# Altium project 1240MHZ-Reciever.PrjPcb
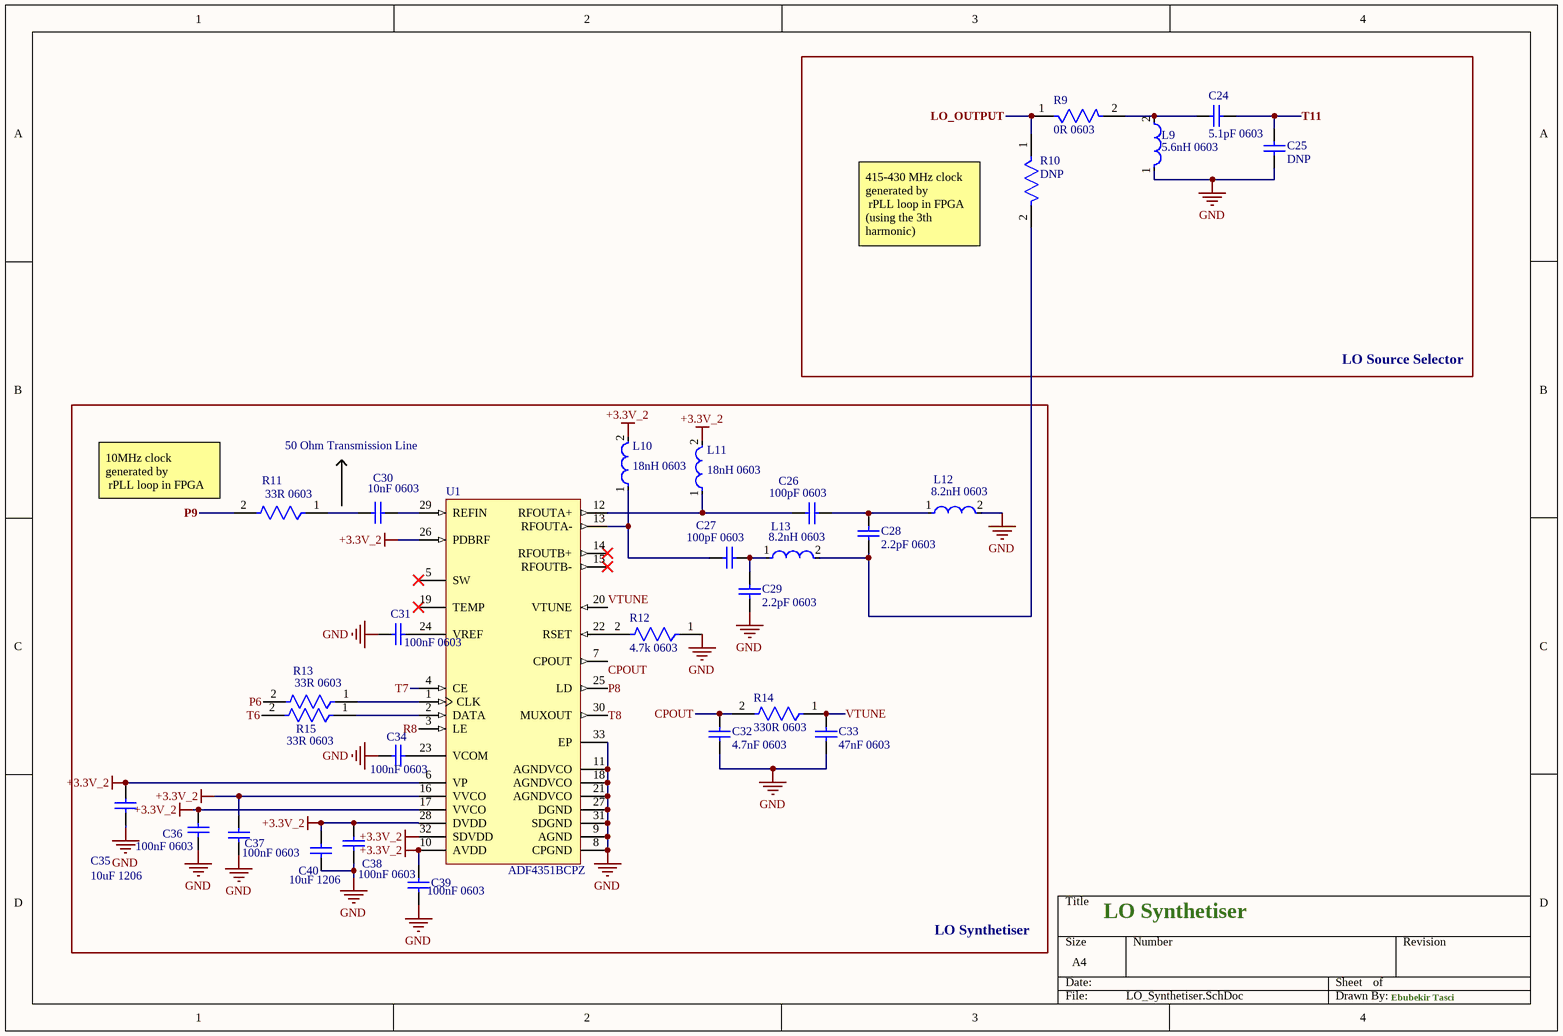
[diagram p0: LO_Synthetiser.SchDoc]
3 sheets, 113 parts. Net scope: global (net labels, ports and power ports of the same name join across sheets).
Board file: Main.PcbDoc
Sheets:
  LO_Synthetiser.SchDoc
  BaseBand.SchDoc
  Headers_Power.SchDoc

## Sheet LO_Synthetiser.SchDoc
size A4; SheetNumber: 1; SheetTotal: 4

### Parts
C24  5.1pF 0603  [CAPC0603(1608)100_L]
C25  DNP  [CAPC0603(1608)100_L]
C26  100pF 0603  [CAPC1608X92X38LL15T08]
C27  100pF 0603  [CAPC1608X92X38LL15T08]
C28  2.2pF 0603  [CAPC0603(1608)100_L]
C29  2.2pF 0603  [CAPC0603(1608)100_L]
C30  10nF 0603  [CAPC0603(1608)100_L]
C31  100nF 0603  [CAPC0603(1608)100_L]
C32  4.7nF 0603  [CAPC0603(1608)100_L]
C33  47nF 0603  [CAPC0603(1608)100_L]
C34  100nF 0603  [CAPC0603(1608)100_L]
C35  10uF 1206  [CAPC1206(3216)190_M]
C36  100nF 0603  [CAPC0603(1608)100_L]
C37  100nF 0603  [CAPC0603(1608)100_L]
C38  100nF 0603  [CAPC0603(1608)100_L]
C39  100nF 0603  [CAPC0603(1608)100_L]
C40  10uF 1206  [CAPC1206(3216)190_M]
L9  5.6nH 0603  [FP-AISC-0603HP-MFG]
L10  18nH 0603  [FP-AISC-0603HP-MFG]
L11  18nH 0603  [FP-AISC-0603HP-MFG]
L12  8.2nH 0603  [FP-AISC-0603HP-MFG]
L13  8.2nH 0603  [FP-AISC-0603HP-MFG]
R9  0R 0603  [FP-CPF0603-MFG]
R10  DNP  [FP-CPF0603-MFG]
R11  33R 0603  [FP-CPF0603-MFG]
R12  4.7k 0603  [FP-CPF0603-MFG]
R13  33R 0603  [FP-CPF0603-MFG]
R14  330R 0603  [FP-CPF0603-MFG]
R15  33R 0603  [FP-CPF0603-MFG]
U1  ADF4351BCPZ  [ADI-CP-32-2_N]

### Blocks framed on the sheet
LO Source Selector: C24 C25 L9 R9 R10
LO Synthetiser: C26-C40 L10-L13 R11-R15 U1

### Nets
+3.3V_2: C35.1 C36.1 C37.1 C38.1 C39.1 C40.2 L10.2 L11.2 U1.6(VP) U1.10(AVDD) U1.16(VVCO) U1.17(VVCO) U1.26(PDBRF) U1.28(DVDD) U1.32(SDVDD)
GND: C25.1 C29.1 C31.2 C32.2 C33.2 C34.2 C35.2 C36.2 C37.2 C38.2 C39.2 C40.1 L9.1 L12.2 R12.1 U1.8(CPGND) U1.9(AGND) U1.11(AGNDVCO) U1.18(AGNDVCO) U1.21(AGNDVCO) U1.27(DGND) U1.31(SDGND) U1.33(EP)
CPOUT: C32.1 R14.2 U1.7(CPOUT)
LO_OUTPUT: R9.1 R10.1
P6: R13.2
P8: U1.25(LD)
P9: R11.2
R8: U1.3(LE)
T6: R15.2
T7: U1.4(CE)
T8: U1.30(MUXOUT)
T11: C24.2 C25.2
VTUNE: C33.1 R14.1 U1.20(VTUNE)
NetC24_1: C24.1 L9.2 R9.2
NetC26_1: C26.1 L11.1 U1.12(RFOUTA+)
NetC26_2: C26.2 C28.2 L12.1
NetC27_1: C27.1 L10.1 U1.13(RFOUTA-)
NetC27_2: C27.2 C29.2 L13.1
NetC28_1: C28.1 L13.2 R10.2
NetC30_1: C30.1 U1.29(REFIN)
NetC30_2: C30.2 R11.1
NetC31_1: C31.1 U1.24(VREF)
NetC34_1: C34.1 U1.23(VCOM)
NetR12_2: R12.2 U1.22(RSET)
NetR13_1: R13.1 U1.1(CLK)
NetR15_1: R15.1 U1.2(DATA)

Not connected (* = marked no-connect by the designer): U1 5(SW)* 14(RFOUTB+)* 15(RFOUTB-)* 19(TEMP)*

### Notes on the sheet
- (near R10) 415-430 MHz clock generated by
  rPLL loop in FPGA (using the 3th harmonic)
- 50 Ohm Transmission Line
- (near R11) 10MHz clock generated by
  rPLL loop in FPGA
- LO Synthetiser
- Ebubekir Tasci

### Library data of the parts
C24 = CMP-1035-00228-1: 0603 5.1pF; Case-EIA: 0603; Case-Metric: 1608; Max Thickness: 1 mm; Technology: SMT
C25 = CMP-1035-00228-1: 0603 Extra Pad; Case-EIA: 0603; Case-Metric: 1608; Max Thickness: 1 mm; Technology: SMT
C26 C27 = CMP-2006-01182-1: Manufacturer: Vitramon; Part Number: VJ0603A101FXAAC
C28 C29 = CMP-1035-00228-1: CAP 2.2pF 16V ±0.1pF 0603 (1608 Metric) Thickness 1mm SMD; Case-EIA: 0603; Tolerance: Â±0.1pF; Case-Metric: 1608; Max Thickness: 1 mm; Technology: SMT; Value: 2.2pF; Rated Voltage: 16 V
C30 = CMP-1035-00228-1: CAP 10nF 16V ±0.1pF 0603 (1608 Metric) Thickness 1mm SMD; Case-EIA: 0603; Tolerance: Â±0.1pF; Case-Metric: 1608; Max Thickness: 1 mm; Technology: SMT; Value: 10nF; Rated Voltage: 16 V
C31 C34 C36-C39 = CMP-1035-00228-1: CAP 100nF 16V ±0.1pF 0603 (1608 Metric) Thickness 1mm SMD; Case-EIA: 0603; Tolerance: Â±0.1pF; Case-Metric: 1608; Max Thickness: 1 mm; Technology: SMT; Value: 100nF; Rated Voltage: 16 V
C32 = CMP-1035-00228-1: CAP 4.7nF 16V ±0.1pF 0603 (1608 Metric) Thickness 1mm SMD; Case-EIA: 0603; Tolerance: Â±0.1pF; Case-Metric: 1608; Max Thickness: 1 mm; Technology: SMT; Value: 4.7nF; Rated Voltage: 16 V
C33 = CMP-1035-00228-1: CAP 47nF 16V ±0.1pF 0603 (1608 Metric) Thickness 1mm SMD; Case-EIA: 0603; Tolerance: Â±0.1pF; Case-Metric: 1608; Max Thickness: 1 mm; Technology: SMT; Value: 47nF; Rated Voltage: 16 V
C35 C40 = CMP-1037-04973-1: CAP 10uF 16V ±5% 1206 (3216 Metric) Thickness 1.9mm SMD; Case-EIA: 1206; Case-Metric: 3216; Tolerance: Â±5%; Rated Voltage: 16 V; Value: 10uF; Max Thickness: 1.9 mm; Technology: SMT
L9 = CMP-27750-000002-1: 5.6nH Wirewound 0603; Height - Seated (Max): 0.04inch; RoHS Compliant: Yes; Height: 1.02mm; Case Code (Metric): 1608; Package Quantity: 1; Packaging: Tape and Reel; Termination: SMD/SMT; Case Code (Imperial): 0603; Width: 1.12mm; Length: 0.071inch; Case/Package: 0603; Mount: Surface Mount
L10 L11 = CMP-27750-000002-1: 18nH Wirewound 0603; Height - Seated (Max): 0.04inch; RoHS Compliant: Yes; Height: 1.02mm; Case Code (Metric): 1608; Package Quantity: 1; Packaging: Tape and Reel; Termination: SMD/SMT; Case Code (Imperial): 0603; Width: 1.12mm; Length: 0.071inch; Case/Package: 0603; Mount: Surface Mount
L12 L13 = CMP-27750-000002-1: FIXED IND 8.2NH SMD; Shielding: Unshielded; Core Material: Ceramic; Tolerance: 5%; Height - Seated (Max): 0.04inch; RoHS Compliant: Yes; Height: 1.02mm; Case Code (Metric): 1608; Inductance: 8.2nH; Package Quantity: 1; Packaging: Tape and Reel; Min Operating Temperature: -40°C; Termination: SMD/SMT; Case Code (Imperial): 0603; Width: 1.12mm; Length: 0.071inch; Case/Package: 0603; Mount: Surface Mount
R9 = CMP-03211-006902-1: RES SMD 0Ω 0.1% 1/16W 0603; Manufacturer Part Number: CPF0603B430RE1; Manufacturer: TE Connectivity; Power Rating: 0.063W; Temperature Coefficient: 25ppm/°C; Voltage Rating: 50V; Lead Free: Yes; Temperature: -55°C to +155°C; Device Class L3: Chip SMD Resistors; RoHS: TRUE; packaging: 1k Reel; ComponentLink2Description: Datasheet; Category: Res; Resistance: 0Ω; Octopart: https://octopart.com/cpf0603b430re1-te+connectivity-22738753; Automotive: No; Height: 0.55mm; Package: CPF0603; octopart_url: https://octopart.com/cpf0603b430re1-te+connectivity-22738753; ComponentLink2URL: https://www.te.com/commerce/DocumentDelivery/DDEController?Action=showdoc&DocId=Data+Sheet%7F1773200%7FM%7Fpdf%7FEnglish%7FENG_DS_1773200_M.pdf%7F3-1676481-2; Series: CPF; Composition: Thin Film; Device Class L2: Resistors; Tolerance: 0.1%; Ipc Land Pattern Name: RESC15580X45; Value: 0Ω; Device Class L1: Passive Components; Temperature Range High: +155°C; Temperature Range Low: -55°C
R10 = CMP-03211-006902-1: Manufacturer Part Number: CPF0603B430RE1; Manufacturer: TE Connectivity; Resistance: 0Ω; Tolerance: 0.1%; Value: 0Ω; Power Rating: 0.063W; Temperature Coefficient: 25ppm/°C; Voltage Rating: 50V; Lead Free: Yes; Temperature: -55°C to +155°C; Device Class L3: Chip SMD Resistors; RoHS: TRUE; packaging: 1k Reel; ComponentLink2Description: Datasheet; Category: Res; Octopart: https://octopart.com/cpf0603b430re1-te+connectivity-22738753; Automotive: No; Height: 0.55mm; Package: CPF0603; octopart_url: https://octopart.com/cpf0603b430re1-te+connectivity-22738753; ComponentLink2URL: https://www.te.com/commerce/DocumentDelivery/DDEController?Action=showdoc&DocId=Data+Sheet%7F1773200%7FM%7Fpdf%7FEnglish%7FENG_DS_1773200_M.pdf%7F3-1676481-2; Series: CPF; Composition: Thin Film; Device Class L2: Resistors; Ipc Land Pattern Name: RESC15580X45; Device Class L1: Passive Components; Temperature Range High: +155°C; Temperature Range Low: -55°C
R11 R13 R15 = CMP-03211-006902-1: RES SMD 33Ω 0.1% 1/16W 0603; Manufacturer Part Number: CPF0603B430RE1; Manufacturer: TE Connectivity; Power Rating: 0.063W; Temperature Coefficient: 25ppm/°C; Voltage Rating: 50V; Lead Free: Yes; Temperature: -55°C to +155°C; Device Class L3: Chip SMD Resistors; RoHS: TRUE; packaging: 1k Reel; ComponentLink2Description: Datasheet; Category: Res; Resistance: 33Ω; Octopart: https://octopart.com/cpf0603b430re1-te+connectivity-22738753; Automotive: No; Height: 0.55mm; Package: CPF0603; octopart_url: https://octopart.com/cpf0603b430re1-te+connectivity-22738753; ComponentLink2URL: https://www.te.com/commerce/DocumentDelivery/DDEController?Action=showdoc&DocId=Data+Sheet%7F1773200%7FM%7Fpdf%7FEnglish%7FENG_DS_1773200_M.pdf%7F3-1676481-2; Series: CPF; Composition: Thin Film; Device Class L2: Resistors; Tolerance: 0.1%; Ipc Land Pattern Name: RESC15580X45; Value: 33Ω; Device Class L1: Passive Components; Temperature Range High: +155°C; Temperature Range Low: -55°C
R12 = CMP-03211-011109-1: RES SMD 4.7kΩ 0.1% 1/16W 0603; Manufacturer: TE Connectivity; Manufacturer Part Number: CPF0603B15RE; Power Rating: 0.063W; Temperature Coefficient: 25ppm/°C; Voltage Rating: 50V; Height: 0.55mm; Tolerance: 0.1%; Value: 4.7kΩ; Device Class L1: Passive Components; Temperature Range Low: -55°C; ComponentLink2Description: Datasheet; Device Class L3: Chip SMD Resistors; Package: CPF0603; Device Class L2: Resistors; Series: CPF; Temperature: -55°C to +155°C; packaging: 5k Reel; Temperature Range High: +155°C; Automotive: No; Composition: Thin Film; Ipc Land Pattern Name: RESC15580X45; RoHS: TRUE; ComponentLink2URL: https://www.te.com/commerce/DocumentDelivery/DDEController?Action=showdoc&DocId=Data+Sheet%7F1773200%7FM%7Fpdf%7FEnglish%7FENG_DS_1773200_M.pdf%7F3-1676481-2; Category: Res; Octopart: https://octopart.com/cpf0603b15re-te+connectivity-23283246; Lead Free: Yes; Resistance: 4.7kΩ; octopart_url: https://octopart.com/cpf0603b15re-te+connectivity-23283246
R14 = CMP-03211-011109-1: RES SMD 330Ω 0.1% 1/16W 0603; Manufacturer: TE Connectivity; Manufacturer Part Number: CPF0603B15RE; Power Rating: 0.063W; Temperature Coefficient: 25ppm/°C; Voltage Rating: 50V; Height: 0.55mm; Tolerance: 0.1%; Value: 330Ω; Device Class L1: Passive Components; Temperature Range Low: -55°C; ComponentLink2Description: Datasheet; Device Class L3: Chip SMD Resistors; Package: CPF0603; Device Class L2: Resistors; Series: CPF; Temperature: -55°C to +155°C; packaging: 5k Reel; Temperature Range High: +155°C; Automotive: No; Composition: Thin Film; Ipc Land Pattern Name: RESC15580X45; RoHS: TRUE; ComponentLink2URL: https://www.te.com/commerce/DocumentDelivery/DDEController?Action=showdoc&DocId=Data+Sheet%7F1773200%7FM%7Fpdf%7FEnglish%7FENG_DS_1773200_M.pdf%7F3-1676481-2; Category: Res; Octopart: https://octopart.com/cpf0603b15re-te+connectivity-23283246; Lead Free: Yes; Resistance: 330Ω; octopart_url: https://octopart.com/cpf0603b15re-te+connectivity-23283246
U1 = CMP-0287-00014-1: Wideband Synthesizer with Integrated VCO, CP-32-2, Pb-Free, 490 Tray; Norm Phase Noise (dBc/Hz): -221dBc; Single/Dual: Single; Supply Current: 110mA; Max REFin (MHz): 250MHz; Max RF Input (MHz): 4.4GHz; Frequency Range: 35MHz-4.4GHz; RF Prescalers: 4/5,8/9; ComponentLink2URL: http://www.analog.com/static/imported-files/data_sheets/ADF4351.pdf; ComponentLink1URL: www.analog.com; ComponentLink1Description: Manufacturer URL; PackageDescription: 32-Lead Lead Frame Chip Scale Package [LFCSP_VQ]; Code_JEDEC: MO-220-VHHD-2; DatasheetVersion: Rev. Pr D; ComponentLink3URL: http://www.analog.com/static/imported-files/packages/414143737956480539664569CP_32_2.pdf; PackageReference: CP-32-2; PackageVersion: Jan-2005; ComponentLink2Description: Datasheet; ComponentLink3Description: Package Specification

## Sheet BaseBand.SchDoc
size A4; SheetNumber: 2; SheetTotal: 4
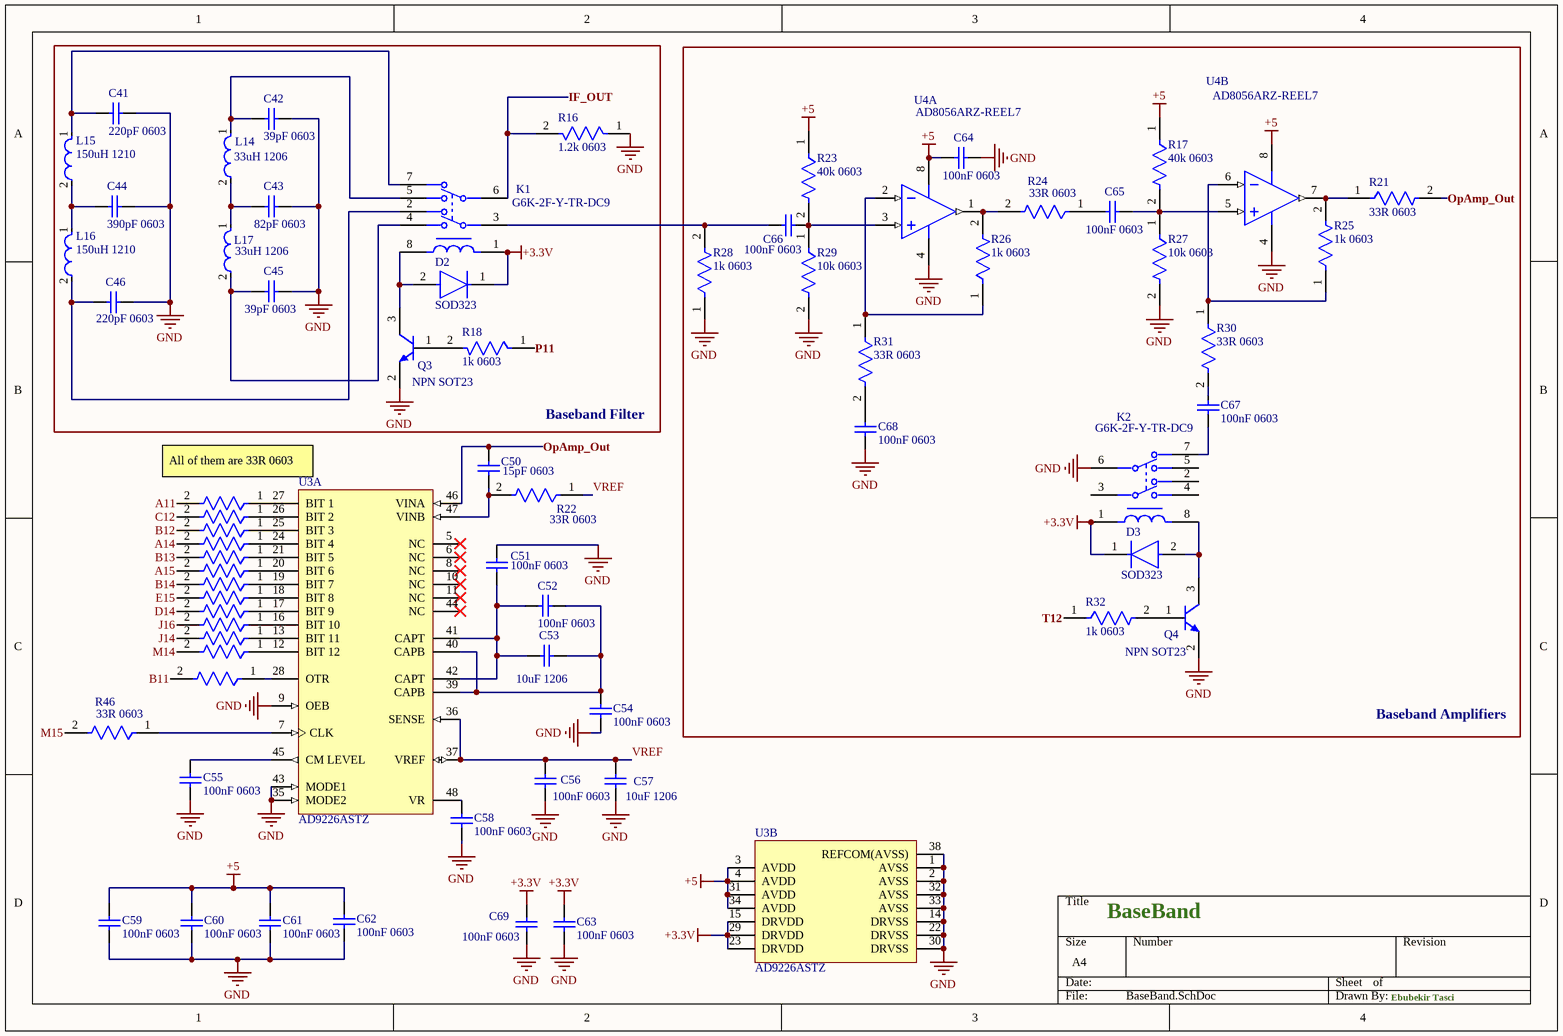
[diagram p1: BaseBand.SchDoc]

### Parts
C41  220pF 0603  [CAPC1608X92X38LL15T08]
C42  39pF 0603  [CAPC1608X92X38LL15T08]
C43  82pF 0603  [CAPC1608X92X38LL15T08]
C44  390pF 0603  [CAPC1608X92X38LL15T08]
C45  39pF 0603  [CAPC1608X92X38LL15T08]
C46  220pF 0603  [CAPC1608X92X38LL15T08]
C50  15pF 0603  [CAPC1608X92X38LL15T08]
C51  100nF 0603  [CAPC0603(1608)100_L]
C52  100nF 0603  [CAPC0603(1608)100_L]
C53  10uF 1206  [CAPC1206(3216)190_M]
C54  100nF 0603  [CAPC0603(1608)100_L]
C55  100nF 0603  [CAPC0603(1608)100_L]
C56  100nF 0603  [CAPC0603(1608)100_L]
C57  10uF 1206  [CAPC1206(3216)190_M]
C58  100nF 0603  [CAPC0603(1608)100_L]
C59  100nF 0603  [CAPC0603(1608)100_L]
C60  100nF 0603  [CAPC0603(1608)100_L]
C61  100nF 0603  [CAPC0603(1608)100_L]
C62  100nF 0603  [CAPC0603(1608)100_L]
C63  100nF 0603  [CAPC0603(1608)100_L]
C64  100nF 0603  [CAPC0603(1608)100_L]
C65  100nF 0603  [CAPC0603(1608)100_L]
C66  100nF 0603  [CAPC0603(1608)100_L]
C67  100nF 0603  [CAPC0603(1608)100_L]
C68  100nF 0603  [CAPC0603(1608)100_L]
C69  100nF 0603  [CAPC0603(1608)100_L]
D2  SOD323  [FP-SOD323F-MFG]
D3  SOD323  [FP-SOD323F-MFG]
K1  G6K-2F-Y-TR-DC9  [FP-G6K-2F-Y-TR-DC9-MFG]
K2  G6K-2F-Y-TR-DC9  [FP-G6K-2F-Y-TR-DC9-MFG]
L14  33uH 1206  [FP-CB3225-IPC_A]
L15  150uH 1210  [FP-LQH32CH_23-MFG]
L16  150uH 1210  [FP-LQH32CH_23-MFG]
L17  33uH 1206  [FP-CB3225-IPC_A]
Q3  NPN SOT23  [ONSC-SOT-23-3-318-08_V]
Q4  NPN SOT23  [ONSC-SOT-23-3-318-08_V]
R16  1.2k 0603  [FP-CPF0603-MFG]
R17  40k 0603  [FP-CPF0603-MFG]
R18  1k 0603  [FP-CPF0603-MFG]
R21  33R 0603  [FP-CPF0603-MFG]
R22  33R 0603  [FP-CPF0603-MFG]
R23  40k 0603  [FP-CPF0603-MFG]
R24  33R 0603  [FP-CPF0603-MFG]
R25  1k 0603  [FP-CPF0603-MFG]
R26  1k 0603  [FP-CPF0603-MFG]
R27  10k 0603  [FP-CPF0603-MFG]
R28  1k 0603  [FP-CPF0603-MFG]
R29  10k 0603  [FP-CPF0603-MFG]
R30  33R 0603  [FP-CPF0603-MFG]
R31  33R 0603  [FP-CPF0603-MFG]
R32  1k 0603  [FP-CPF0603-MFG]
R33  33R 0603  [FP-CPF0603-MFG]  (value not drawn)
R34  33R 0603  [FP-CPF0603-MFG]  (value not drawn)
R35  33R 0603  [FP-CPF0603-MFG]  (value not drawn)
R36  33R 0603  [FP-CPF0603-MFG]  (value not drawn)
R37  33R 0603  [FP-CPF0603-MFG]  (value not drawn)
R38  33R 0603  [FP-CPF0603-MFG]  (value not drawn)
R39  33R 0603  [FP-CPF0603-MFG]  (value not drawn)
R40  33R 0603  [FP-CPF0603-MFG]  (value not drawn)
R41  33R 0603  [FP-CPF0603-MFG]  (value not drawn)
R42  33R 0603  [FP-CPF0603-MFG]  (value not drawn)
R43  33R 0603  [FP-CPF0603-MFG]  (value not drawn)
R44  33R 0603  [FP-CPF0603-MFG]  (value not drawn)
R45  33R 0603  [FP-CPF0603-MFG]  (value not drawn)
R46  33R 0603  [FP-CPF0603-MFG]
U3  AD9226ASTZ  [ST-48_N]  (parts A,B of 2)
U4  AD8056ARZ-REEL7  [ADI-R-8_M]  (parts A,B of 2)

### Blocks framed on the sheet
Baseband Filter: C41-C46 D2 K1 L14-L17 Q3 R16 R18
Baseband Amplifiers: C64-C68 D3 K2 Q4 R17 R21 R23-R32 U4

### Nets
+3.3V: C63.1 C69.1 D2.1(C) D3.1(C) K1.1 K2.1 U3.15(DRVDD) U3.23(DRVDD) U3.29(DRVDD)
+5: C59.1 C60.1 C61.1 C62.1 C64.2 R17.1 R23.1 U3.3(AVDD) U3.4(AVDD) U3.31(AVDD) U3.34(AVDD) U4.8(+VS)
GND: C41.1 C42.1 C43.1 C44.1 C45.1 C46.1 C51.2 C54.1 C55.2 C56.2 C57.1 C58.2 C59.2 C60.2 C61.2 C62.2 C63.2 C64.1 C68.2 C69.2 K2.6 Q3.2(E) Q4.2(E) R16.1 R27.2 R28.1 R29.2 U3.1(AVSS) U3.2(AVSS) U3.9(OEB) U3.14(DRVSS) U3.22(DRVSS) U3.30(DRVSS) U3.32(AVSS) U3.33(AVSS) U3.35(MODE2) U3.38(REFCOM(AVSS)) U3.43(MODE1) U4.4(-VS)
A11: R33.2
A14: R36.2
A15: R38.2
B11: R45.2
B12: R35.2
B13: R37.2
B14: R39.2
C12: R34.2
D14: R41.2
E15: R40.2
IF_OUT: K1.6 R16.2
J14: R43.2
J16: R42.2
M14: R44.2
M15: R46.2
OpAmp_Out: C50.2 R21.2 U3.46(VINA)
P11: R18.1
T12: R32.1
VREF: C56.1 C57.2 R22.1 U3.36(SENSE) U3.37(VREF)
NetC41_2: C41.2 K1.7 L15.1
NetC42_2: C42.2 K1.5 L14.1
NetC43_2: C43.2 L14.2 L17.1
NetC44_2: C44.2 L15.2 L16.1
NetC45_2: C45.2 K1.4 L17.2
NetC46_2: C46.2 K1.2 L16.2
NetC50_1: C50.1 R22.2 U3.47(VINB)
NetC51_1: C51.1 C52.1 C53.2 U3.41(CAPT) U3.42(CAPT)
NetC52_2: C52.2 C53.1 C54.2 U3.39(CAPB) U3.40(CAPB)
NetC55_1: C55.1 U3.45(CM_LEVEL)
NetC58_1: C58.1 U3.48(VR)
NetC65_1: C65.1 R17.2 R27.1 U4.5(+IN_2)
NetC65_2: C65.2 R24.1
NetC66_1: C66.1 R23.2 R29.1 U4.3(+IN_1)
NetC66_2: C66.2 K1.3 R28.2
NetC67_1: C67.1 R30.2
NetC67_2: C67.2 K2.7
NetC68_1: C68.1 R31.2
NetD2_2: D2.2(A) K1.8 Q3.3(C)
NetD3_2: D3.2(A) K2.8 Q4.3(C)
NetQ3_1: Q3.1(B) R18.2
NetQ4_1: Q4.1(B) R32.2
NetR21_1: R21.1 R25.2 U4.7(OUT_2)
NetR24_2: R24.2 R26.2 U4.1(OUT_1)
NetR25_1: R25.1 R30.1 U4.6(-IN_2)
NetR26_1: R26.1 R31.1 U4.2(-IN_1)
NetR33_1: R33.1 U3.27(BIT_1)
NetR34_1: R34.1 U3.26(BIT_2)
NetR35_1: R35.1 U3.25(BIT_3)
NetR36_1: R36.1 U3.24(BIT_4)
NetR37_1: R37.1 U3.21(BIT_5)
NetR38_1: R38.1 U3.20(BIT_6)
NetR39_1: R39.1 U3.19(BIT_7)
NetR40_1: R40.1 U3.18(BIT_8)
NetR41_1: R41.1 U3.17(BIT_9)
NetR42_1: R42.1 U3.16(BIT_10)
NetR43_1: R43.1 U3.13(BIT_11)
NetR44_1: R44.1 U3.12(BIT_12)
NetR45_1: R45.1 U3.28(OTR)
NetR46_1: R46.1 U3.7(CLK)

Not connected (* = marked no-connect by the designer): K2 2 3 4 5; U3 5(NC)* 6(NC)* 8(NC)* 10(NC)* 11(NC)* 44(NC)*

### Notes on the sheet
- All of them are 33R 0603
- BaseBand
- Ebubekir Tasci

### Library data of the parts
C41-C46 C50 = CMP-2006-01182-1: as C26 on sheet LO_Synthetiser
C51 C52 C54-C56 C58-C69 = CMP-1035-00228-1: as C31 on sheet LO_Synthetiser; Max Thickness: 1 mm; Technology: SMT; Value: 100nF; Rated Voltage: 16 V
C53 C57 = CMP-1037-04973-1: as C35 on sheet LO_Synthetiser; Rated Voltage: 16 V; Value: 10uF; Max Thickness: 1.9 mm; Technology: SMT
D2 D3 = CMP-12791-000029-1: DIODE GEN PURP 100V 250MA SOD323; Manufacturer Part Number: 1N4148WSF-7; Manufacturer: Diodes Inc.; Value: 1.5pF; Max Surge Forward Current: 0.5A; Peak Reverse Current: 0.5uA; Max Junction Temp: +150°C; Height: 0.75mm; Digikey Description: DIODE GEN PURP 100V 250MA SOD323; Automotive: No; Footprint Url: https://www.diodes.com/assets/Package-Files/SOD323F.pdf; Category: Diode; Max Repetitive Reverse Voltage: 100V; Lead Free: Yes; Temperature Range High: +150°C; Forward Current: 250mA; Reverse Voltage: 100V; Device Class L3: Rectifier Diodes; ComponentLink2URL: https://www.diodes.com/assets/Datasheets/1N4148WSF.pdf; Package: SOD323F; RoHS: TRUE; Mouser Description: Diodes - General Purpose, Power, Switching 200mW 2pF 75Vrrm 150mA 2A 1VF; Temperature: -55°C to +150°C; Capacitance: 1.5pF; Device Class L2: Diodes; ComponentLink2Description: Datasheet; Device Class L1: Discrete Semiconductors; Octopart: https://octopart.com/1n4148wsf-7-diodes+inc.-33798544; Temperature Range Low: -55°C
K1 K2 = CMP-08823-000027-1: RELAY TELECOM DPDT 1A 9VDC; Coil Type: Non-Latching; Coil Power: 100mW; Release Time: 3ms; Coil Resistance: 795R; Max Voltage Rating (AC): 125V; Coil Current: 11.3mA; Coil Voltage (DC): 9V; Max Voltage Rating (DC): 60V; Mount: Surface Mount; Packaging: Tape and Reel; Contact Material: Gold; Package Quantity: 1800; Contact Current Rating: 1A; Power Consumption: 100mW; Lead Free: Lead Free; Radiation Hardening: No; Throw Configuration: DPDT; Min Operating Temperature: -40°C; Number of Pins: 8; RoHS Compliant: Yes; Max Current Rating: 1A; Operate Time: 3ms; Relay Type: Telecom; Max Operating Temperature: 70°C; Termination: Gull Wing; Series: G6K
L14 L17 = CMP-14484-000067-1: SMD Inductors 33uH ±10% 0.57A 0.533Ω 1210; Saturation Current: 500mA; Shielding: Unshielded; Test Frequency: 100kHz; DC Current: 570mA; DC Resistance (DCR): 533mR; Self Resonant Frequency: 13MHz; Core Material: Ferrite; Termination: SMD/SMT; Min Operating Temperature: -40°C; Width: 0.098inch; Case Code (Imperial): 1210; Depth: 2.7mm; Length: 3.2mm; Case Code (Metric): 3225; Max Operating Temperature: 105°C; Inductance: 33uH; Current Rating: 570mA; Military Standard: Not; Tolerance: 10%; Lead Free: Lead Free; Package Quantity: 1000; Height: 2.5mm; Height - Seated (Max): 0.106inch; Max DC Current: 570mA; Resistor Type: Wirewound; Series: CBC; Packaging: Tape and Reel; Halogen Free: Halogen Free; Case/Package: 1210; Radiation Hardening: No; RoHS Compliant: Yes; Mount: Surface Mount; Inductance Tolerance: 10%
L15 L16 = CMP-06042-012094-2: Wire Wound Ferrite Inductor for General Circuits 150μH ±10% 9.3Ω 70mA 1210; Q Factor: 40; Shielding: Unshielded; DC Resistance (DCR): 9.3R; Frequency: 7MHz; Test Frequency: 1MHz; Inductance: 150uH; Packaging: Tape and Reel; Series: LQH32M; Core Material: Ferrite; Min Operating Temperature: -40°C; Military Standard: Not; RoHS Compliant: Yes; Termination: SMD/SMT; Depth: 2.7mm; Radiation Hardening: No; Self Resonant Frequency: 7MHz; Max Operating Temperature: 85°C; Width: 2.5mm; Lead Free: Lead Free; Case Code (Metric): 3225; Current Rating: 70mA; Mount: Surface Mount; Package Quantity: 2000; Max DC Current: 70mA; Height: 2mm; Weight: 0.002116oz; DC Current: 70mA; Case Code (Imperial): 1210; Tolerance: 10%; Case/Package: 1210; Length: 3.2mm
Q3 Q4 = CMP-1048-00598-1: VHF / UHF Transistor, NPN Silicon, 3-Pin SOT-23, Pb-Free, Tape and Reel; Manufacturer: On Semiconductor; PartNumber: NSVMMBTH10LT1G; fT Min (MHz): 650; ComponentLink1URL: http://www.onsemi.com/; PackageReference: SOT-23-3-318-08; Mounting Technology: Surface Mount; PackageVersion: Rev. AP, 11/2009; DatasheetVersion: Rev. 5; Packing: Tape and Reel; RoHS: TRUE; ComponentLink3Description: Package Specification; Polarity: NPN; ComponentLink2URL: http://www.onsemi.cn/pub_link/Collateral/MMBTH10LT1-D.PDF; ComponentLink3URL: http://www.onsemi.cn/pub_link/Collateral/318-08.PDF; PackageDescription: 3-Pin Small Outline Transistor, Body 2.92 x 1.3 mm, Pitch 0.95 mm; ComponentLink2Description: Datasheet; ComponentLink1Description: Manufacturer URL
R16 = CMP-03211-006902-1: RES SMD 1.2kΩ 0.1% 1/16W 0603; Manufacturer Part Number: CPF0603B430RE1; Manufacturer: TE Connectivity; Power Rating: 0.063W; Temperature Coefficient: 25ppm/°C; Voltage Rating: 50V; Lead Free: Yes; Temperature: -55°C to +155°C; Device Class L3: Chip SMD Resistors; RoHS: TRUE; packaging: 1k Reel; ComponentLink2Description: Datasheet; Category: Res; Resistance: 1.2kΩ; Octopart: https://octopart.com/cpf0603b430re1-te+connectivity-22738753; Automotive: No; Height: 0.55mm; Package: CPF0603; octopart_url: https://octopart.com/cpf0603b430re1-te+connectivity-22738753; ComponentLink2URL: https://www.te.com/commerce/DocumentDelivery/DDEController?Action=showdoc&DocId=Data+Sheet%7F1773200%7FM%7Fpdf%7FEnglish%7FENG_DS_1773200_M.pdf%7F3-1676481-2; Series: CPF; Composition: Thin Film; Device Class L2: Resistors; Tolerance: 0.1%; Ipc Land Pattern Name: RESC15580X45; Value: 1.2kΩ; Device Class L1: Passive Components; Temperature Range High: +155°C; Temperature Range Low: -55°C
R17 R23 = CMP-03211-006902-1: RES SMD 40kΩ 0.1% 1/16W 0603; Manufacturer Part Number: CPF0603B430RE1; Manufacturer: TE Connectivity; Power Rating: 0.063W; Temperature Coefficient: 25ppm/°C; Voltage Rating: 50V; Lead Free: Yes; Temperature: -55°C to +155°C; Device Class L3: Chip SMD Resistors; RoHS: TRUE; packaging: 1k Reel; ComponentLink2Description: Datasheet; Category: Res; Resistance: 40kΩ; Octopart: https://octopart.com/cpf0603b430re1-te+connectivity-22738753; Automotive: No; Height: 0.55mm; Package: CPF0603; octopart_url: https://octopart.com/cpf0603b430re1-te+connectivity-22738753; ComponentLink2URL: https://www.te.com/commerce/DocumentDelivery/DDEController?Action=showdoc&DocId=Data+Sheet%7F1773200%7FM%7Fpdf%7FEnglish%7FENG_DS_1773200_M.pdf%7F3-1676481-2; Series: CPF; Composition: Thin Film; Device Class L2: Resistors; Tolerance: 0.1%; Ipc Land Pattern Name: RESC15580X45; Value: 40kΩ; Device Class L1: Passive Components; Temperature Range High: +155°C; Temperature Range Low: -55°C
R18 R25 R26 R28 R32 = CMP-03211-006902-1: RES SMD 1kΩ 0.1% 1/16W 0603; Manufacturer Part Number: CPF0603B430RE1; Manufacturer: TE Connectivity; Resistance: 1.2kΩ; Value: 1.2kΩ; Power Rating: 0.063W; Temperature Coefficient: 25ppm/°C; Voltage Rating: 50V; Lead Free: Yes; Temperature: -55°C to +155°C; Device Class L3: Chip SMD Resistors; RoHS: TRUE; packaging: 1k Reel; ComponentLink2Description: Datasheet; Category: Res; Octopart: https://octopart.com/cpf0603b430re1-te+connectivity-22738753; Automotive: No; Height: 0.55mm; Package: CPF0603; octopart_url: https://octopart.com/cpf0603b430re1-te+connectivity-22738753; ComponentLink2URL: https://www.te.com/commerce/DocumentDelivery/DDEController?Action=showdoc&DocId=Data+Sheet%7F1773200%7FM%7Fpdf%7FEnglish%7FENG_DS_1773200_M.pdf%7F3-1676481-2; Series: CPF; Composition: Thin Film; Device Class L2: Resistors; Tolerance: 0.1%; Ipc Land Pattern Name: RESC15580X45; Device Class L1: Passive Components; Temperature Range High: +155°C; Temperature Range Low: -55°C
R21 R22 = CMP-03211-011109-1: RES SMD 33Ω 0.1% 1/16W 0603; Manufacturer: TE Connectivity; Manufacturer Part Number: CPF0603B15RE; Power Rating: 0.063W; Temperature Coefficient: 25ppm/°C; Voltage Rating: 50V; Height: 0.55mm; Tolerance: 0.1%; Value: 33Ω; Device Class L1: Passive Components; Temperature Range Low: -55°C; ComponentLink2Description: Datasheet; Device Class L3: Chip SMD Resistors; Package: CPF0603; Device Class L2: Resistors; Series: CPF; Temperature: -55°C to +155°C; packaging: 5k Reel; Temperature Range High: +155°C; Automotive: No; Composition: Thin Film; Ipc Land Pattern Name: RESC15580X45; RoHS: TRUE; ComponentLink2URL: https://www.te.com/commerce/DocumentDelivery/DDEController?Action=showdoc&DocId=Data+Sheet%7F1773200%7FM%7Fpdf%7FEnglish%7FENG_DS_1773200_M.pdf%7F3-1676481-2; Category: Res; Octopart: https://octopart.com/cpf0603b15re-te+connectivity-23283246; Lead Free: Yes; Resistance: 33Ω; octopart_url: https://octopart.com/cpf0603b15re-te+connectivity-23283246
R24 R30 R31 R33-R46 = CMP-03211-006902-1: as R11 on sheet LO_Synthetiser; Lead Free: Yes; Temperature: -55°C to +155°C; Device Class L3: Chip SMD Resistors; RoHS: TRUE; packaging: 1k Reel; ComponentLink2Description: Datasheet; Category: Res; Resistance: 33Ω; Octopart: https://octopart.com/cpf0603b430re1-te+connectivity-22738753; Automotive: No; Height: 0.55mm; Package: CPF0603; octopart_url: https://octopart.com/cpf0603b430re1-te+connectivity-22738753; ComponentLink2URL: https://www.te.com/commerce/DocumentDelivery/DDEController?Action=showdoc&DocId=Data+Sheet%7F1773200%7FM%7Fpdf%7FEnglish%7FENG_DS_1773200_M.pdf%7F3-1676481-2; Series: CPF; Composition: Thin Film; Device Class L2: Resistors; Tolerance: 0.1%; Ipc Land Pattern Name: RESC15580X45; Value: 33Ω; Device Class L1: Passive Components; Temperature Range High: +155°C; Temperature Range Low: -55°C
R27 R29 = CMP-03211-006902-1: RES SMD 10kΩ 0.1% 1/16W 0603; Manufacturer Part Number: CPF0603B430RE1; Manufacturer: TE Connectivity; Power Rating: 0.063W; Temperature Coefficient: 25ppm/°C; Voltage Rating: 50V; Lead Free: Yes; Temperature: -55°C to +155°C; Device Class L3: Chip SMD Resistors; RoHS: TRUE; packaging: 1k Reel; ComponentLink2Description: Datasheet; Category: Res; Resistance: 10kΩ; Octopart: https://octopart.com/cpf0603b430re1-te+connectivity-22738753; Automotive: No; Height: 0.55mm; Package: CPF0603; octopart_url: https://octopart.com/cpf0603b430re1-te+connectivity-22738753; ComponentLink2URL: https://www.te.com/commerce/DocumentDelivery/DDEController?Action=showdoc&DocId=Data+Sheet%7F1773200%7FM%7Fpdf%7FEnglish%7FENG_DS_1773200_M.pdf%7F3-1676481-2; Series: CPF; Composition: Thin Film; Device Class L2: Resistors; Tolerance: 0.1%; Ipc Land Pattern Name: RESC15580X45; Value: 10kΩ; Device Class L1: Passive Components; Temperature Range High: +155°C; Temperature Range Low: -55°C
U3 = CMP-0313-00803-2: Single 12-Bit Analog-to-Digital Converter with Parallel Interface, 65MSPS, -40 to +85 degC, ST-48, Pb-Free, Tray; Generic Part Number: AD9226; Manufacturer: Analog Devices; Resolution (Bits): 12; Channels: 1; Interface: Par; Throughput Rate (SPS): 65M; ComponentLink3Description: Package Specification; Mounting Technology: Surface Mount; PartNumber: AD9226ASTZ; RoHS: Y; Packing: Tray; ComponentLink4Description: Product URL; PackageVersion: revA; ComponentLink1URL: http://www.analog.com/en/index.html; ComponentLink3URL: http://www.analog.com/static/imported-files/packages/PKG_PDF/LQFP%28ST%29/ST_48.pdf; PackageDescription: 48-Pin Thin Quad Flat Pack 0.5 mm Pitch; ComponentLink1Description: Manufacturer URL; DatasheetVersion: Rev.B; ComponentLink2Description: Datasheet; PackageReference: ST-48; ComponentLink2URL: http://www.analog.com/static/imported-files/data_sheets/AD9226.pdf; ComponentLink4URL: http://www.analog.com/en/analog-to-digital-converters/ad-converters/ad9226/products/product.html
U4 = CMP-0384-01085-1: Double Channel Low Power Operational Amplifier, 300 MHz BW, 1.4 KV/us SR, Industrial, 8-pin SOIC (R-8), Reel; Generic Part Number: AD8056; Manufacturer: Analog Devices; V Span Max: 12V; Input Offset Voltage: 3mV; Iq/Amp: 6mA; V Span Min: 8V; Small Signal Bandwidth: 300MHz; Amplifiers Per Package: 2; Input Bias Current: 400nA; Packing: Reel; Code_JEDEC: MS-012-AA; ComponentLink2URL: http://www.analog.com/static/imported-files/data_sheets/AD8055_8056.pdf; DatasheetVersion: Rev. J; Slew Rate: 1.4KV/us; ComponentLink3Description: Package Specification; ComponentLink2Description: Datasheet; ComponentLink3URL: http://www.analog.com/static/imported-files/packages/PKG_PDF/SOIC_Narrow%20(R)/R_8.pdf; PackageReference: R-8; PackageVersion: 060506-A; Mounting Technology: Surface Mount; PartNumber: AD8056ARZ-REEL7; ComponentLink1URL: http://www.analog.com/en/index.html; ComponentLink1Description: Manufacturer URL; PackageDescription: 8-Pin Standard Small Outline Package, Body 3.9 x 4.9 mm, Pitch 1.27 mm

## Sheet Headers_Power.SchDoc
size A4; SheetNumber: 3; SheetTotal: 4
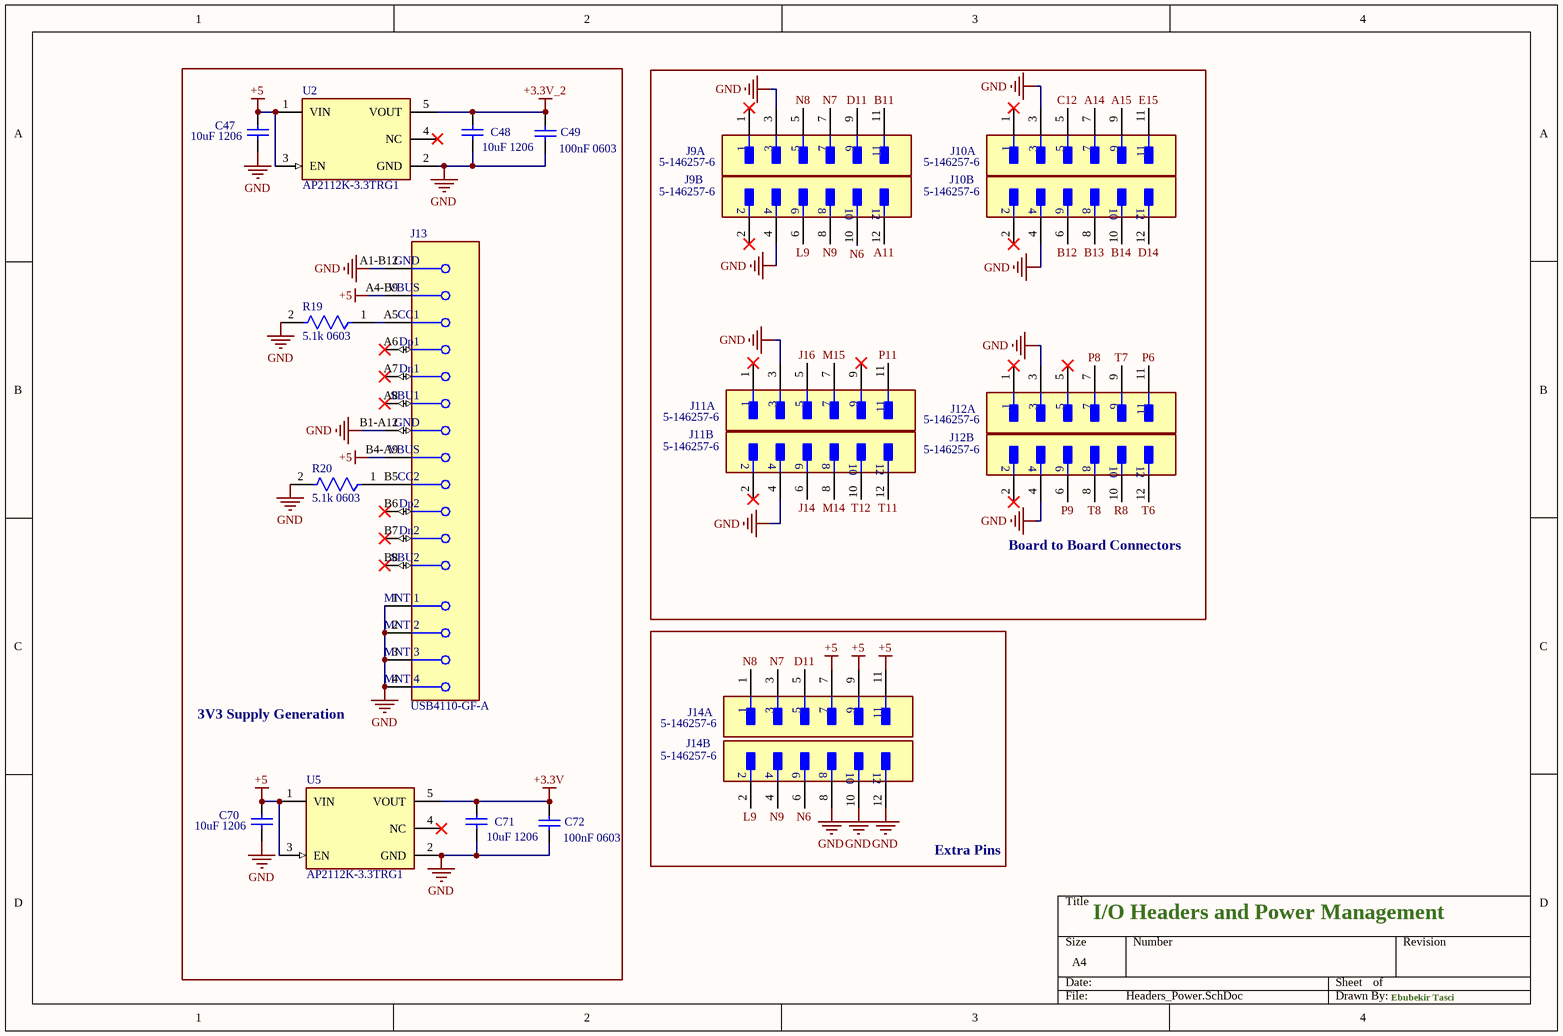
[diagram p2: Headers_Power.SchDoc]

### Parts
C47  10uF 1206  [CAPC1206(3216)190_M]
C48  10uF 1206  [CAPC1206(3216)190_M]
C49  100nF 0603  [CAPC0603(1608)100_L]
C70  10uF 1206  [CAPC1206(3216)190_M]
C71  10uF 1206  [CAPC1206(3216)190_M]
C72  100nF 0603  [CAPC0603(1608)100_L]
J9  5-146257-6  [FP-5-146257-6-MFG]  (parts A,B of 2)
J10  5-146257-6  [FP-5-146257-6-MFG]  (parts A,B of 2)
J11  5-146257-6  [FP-5-146257-6-MFG]  (parts A,B of 2)
J12  5-146257-6  [FP-5-146257-6-MFG]  (parts A,B of 2)
J13  USB4110-GF-A  [FP-USB4110-GF-A-MFG]
J14  5-146257-6  [FP-5-146257-6-MFG]  (parts A,B of 2)
R19  5.1k 0603  [FP-MCT0603-IPC_A]
R20  5.1k 0603  [FP-MCT0603-IPC_A]
U2  AP2112K-3.3TRG1  [FP-SOT25-IPC_A]
U5  AP2112K-3.3TRG1  [FP-SOT25-IPC_A]

### Blocks framed on the sheet
3V3 Supply Generation: C47-C49 C70-C72 J13 R19 R20 U2 U5
Board to Board Connectors: J9-J12
Extra Pins: J14

### Nets
+3.3V: C71.2 C72.1 U5.5(VOUT)
+3.3V_2: C48.2 C49.1 U2.5(VOUT)
+5: C47.2 C70.2 J13.A4-B9(VBUS) J13.B4-A9(VBUS) J14.7 J14.9 J14.11 U2.1(VIN) U2.3(EN) U5.1(VIN) U5.3(EN)
GND: C47.1 C48.1 C49.2 C70.1 C71.1 C72.2 J9.3 J9.4 J10.3 J10.4 J11.3 J11.4 J12.3 J12.4 J13.1(MNT_1) J13.2(MNT_2) J13.3(MNT_3) J13.4(MNT_4) J13.A1-B12(GND) J13.B1-A12(GND) J14.8 J14.10 J14.12 R19.2 R20.2 U2.2(GND) U5.2(GND)
A11: J9.12
A14: J10.7
A15: J10.9
B11: J9.11
B12: J10.6
B13: J10.8
B14: J10.10
C12: J10.5
D11: J9.9 J14.5
D14: J10.12
E15: J10.11
J14: J11.6
J16: J11.5
L9: J9.6 J14.2
M14: J11.8
M15: J11.7
N6: J9.10 J14.6
N7: J9.7 J14.3
N8: J9.5 J14.1
N9: J9.8 J14.4
P6: J12.11
P8: J12.7
P9: J12.6
P11: J11.11
R8: J12.10
T6: J12.12
T7: J12.9
T8: J12.8
T11: J11.12
T12: J11.10
NetJ13_A5: J13.A5(CC1) R19.1
NetJ13_B5: J13.B5(CC2) R20.1

Not connected (* = marked no-connect by the designer): J9 1* 2*; J10 1* 2*; J11 1* 2* 9*; J12 1* 2* 5*; J13 A6(Dp1)* A7(Dn1)* A8(SBU1)* B6(Dp2)* B7(Dn2)* B8(SBU2)*; U2 4(NC)*; U5 4(NC)*

### Notes on the sheet
- I/O Headers and Power Management
- Ebubekir Tasci

### Library data of the parts
C47 C48 C70 C71 = CMP-1037-04973-1: as C35 on sheet LO_Synthetiser; Rated Voltage: 16 V; Value: 10uF; Max Thickness: 1.9 mm; Technology: SMT
C49 C72 = CMP-1035-00228-1: as C31 on sheet LO_Synthetiser; Max Thickness: 1 mm; Technology: SMT; Value: 100nF; Rated Voltage: 16 V
J9-J12 J14 = CMP-03369-000148-1: CONN HEADER VERT 12POS 2.54MM; Gasket: No (Without); Voltage Rating: 750V; Insulation Resistance: 5GR; Keyed: No; PCB Mount Retention: Without; Approvals: CSA; High Temperature Housing: Yes; Board Standoff: Yes (With); Contact Current Rating: 3A; Number of Contacts: 12; PCB Thickness: 0.062inch; Contact Post Length: 0.12inch; PCB Mounting Orientation: Vertical; Connector Type: Plug; Housing Color: Black; Package Quantity: 240; Orientation: Straight; Mating Connector Lock: No (Without); Radiation Hardening: No; Stabilizers: No (Without); Pitch: 2.54mm; Contact Plating: Gold; Contact Gender: Male; Mount: Through Hole; Length: 14.83mm; Depth: 4.88mm; ELV: Compliant; Color: Black; Insulation Color: Black; Max Operating Temperature: 105°C; Contact Material: Bronze; Current Rating: 3A; Housing Material: Thermoplastic; Packaging: Carton; Mating Alignment: No (Without); Number of Rows: 2; Contact Finish - Mating: GOLD; Termination: Through Hole; Fastening Type: Pull; Contact Mating Length: 0.23inch; Number of Positions: 12; Contact Type: Male Pin; RoHS Compliant: Yes; Row Spacing: 2.54mm; Series: AMPMODU MOD II; Min Operating Temperature: -65°C; Contact Protection: No (Without); Flammability Rating: UL94 V-0; High Speed Serial Data Connector: No; Insulation Material: Polymer; Contact Shape: Square; Selectively Loaded: No (Without); Strain Relief: No (Without)
J13 = CMP-245163-000002-1: CONN USB 2.0 TYPE-C R/A SMT; Manufacturer: GCT; Conn Orientation: Right Angle; Usb Standard: USB 2.0; Voltage Rating: 20V; Current Rating: 3/4.25/1.25/0.25A; Number Of Contacts: 16; Is Female: yes; Shielding: true; Standoff Height: 0.1mm; Octopart: https://octopart.com/usb4110-gf-a-gct-103941985; Temperature: -40°C to +85°C; RoHS: TRUE; Automotive: No; Contact Material: Gold,Nickel; Device Class L1: Connectors; Device Class L2: USB Connectors; Package: 0; Lead Free: Yes; ComponentLink2URL: https://gct.co/files/drawings/usb4110.pdf; Temperature Range High: +85°C; Temperature Range Low: -40°C; Height: 3.46mm; Manufacturer Part Number: USB4110-GF-A; ComponentLink2Description: Datasheet; Device Class L3: unset; Digikey Description: CONN USB 2.0 TYPE-C R/A SMT; Category: Conn
R19 R20 = CMP-02407-005940-1: RES SMD 5.1 KOHM 1% 1/8W 0603; Composition: Thin Film; Depth: 0.85mm; Min Operating Temperature: -55°C; Military Standard: Not; Length: 1.55mm; Max Operating Temperature: 125°C; Tolerance: 1%; Resistance: 5.1k; Lead Free: Lead Free; Case/Package: 0603; Packaging: Tape and Reel
U2 U5 = CMP-12756-000035-1: IC REG LINEAR 3.3V 600MA SOT25; Number of Regulators: 1; Output Type: Fixed; Polarity: Positive; Min Input Voltage: 2.5V; Max Input Voltage: 6V; Accuracy: 1.5%; Quiescent Current: 55uA; Dropout Voltage: 250mV; Min Operating Temperature: -40°C; Length: 3.1mm; Output Current: 600mA; Max Operating Temperature: 85°C; Package Quantity: 1; Output Voltage: 3.3V; Width: 1.7mm; Number of Outputs: 1; Packaging: Tape and Reel; Height: 1.3mm; Lead Free: Lead Free; Max Output Current: 600mA; Case/Package: SOT-23-5; Mount: Surface Mount; Number of Pins: 5

## Nets that join several sheets
+3.3V: BaseBand (9 pins), Headers_Power (C71.2 C72.1 U5.5)
+3.3V_2: LO_Synthetiser (15 pins), Headers_Power (C48.2 C49.1 U2.5)
+5: BaseBand (12 pins), Headers_Power (11 pins)
GND: LO_Synthetiser (23 pins), BaseBand (39 pins), Headers_Power (27 pins)
A11: BaseBand (R33.2), Headers_Power (J9.12)
A14: BaseBand (R36.2), Headers_Power (J10.7)
A15: BaseBand (R38.2), Headers_Power (J10.9)
B11: BaseBand (R45.2), Headers_Power (J9.11)
B12: BaseBand (R35.2), Headers_Power (J10.6)
B13: BaseBand (R37.2), Headers_Power (J10.8)
B14: BaseBand (R39.2), Headers_Power (J10.10)
C12: BaseBand (R34.2), Headers_Power (J10.5)
D14: BaseBand (R41.2), Headers_Power (J10.12)
E15: BaseBand (R40.2), Headers_Power (J10.11)
J14: BaseBand (R43.2), Headers_Power (J11.6)
J16: BaseBand (R42.2), Headers_Power (J11.5)
M14: BaseBand (R44.2), Headers_Power (J11.8)
M15: BaseBand (R46.2), Headers_Power (J11.7)
P6: LO_Synthetiser (R13.2), Headers_Power (J12.11)
P8: LO_Synthetiser (U1.25), Headers_Power (J12.7)
P9: LO_Synthetiser (R11.2), Headers_Power (J12.6)
P11: BaseBand (R18.1), Headers_Power (J11.11)
R8: LO_Synthetiser (U1.3), Headers_Power (J12.10)
T6: LO_Synthetiser (R15.2), Headers_Power (J12.12)
T7: LO_Synthetiser (U1.4), Headers_Power (J12.9)
T8: LO_Synthetiser (U1.30), Headers_Power (J12.8)
T11: LO_Synthetiser (C24.2 C25.2), Headers_Power (J11.12)
T12: BaseBand (R32.1), Headers_Power (J11.10)